# EAGLE design ESP32_Meteorologia_MTE_AV_2 (EAGLE 9.6.2)
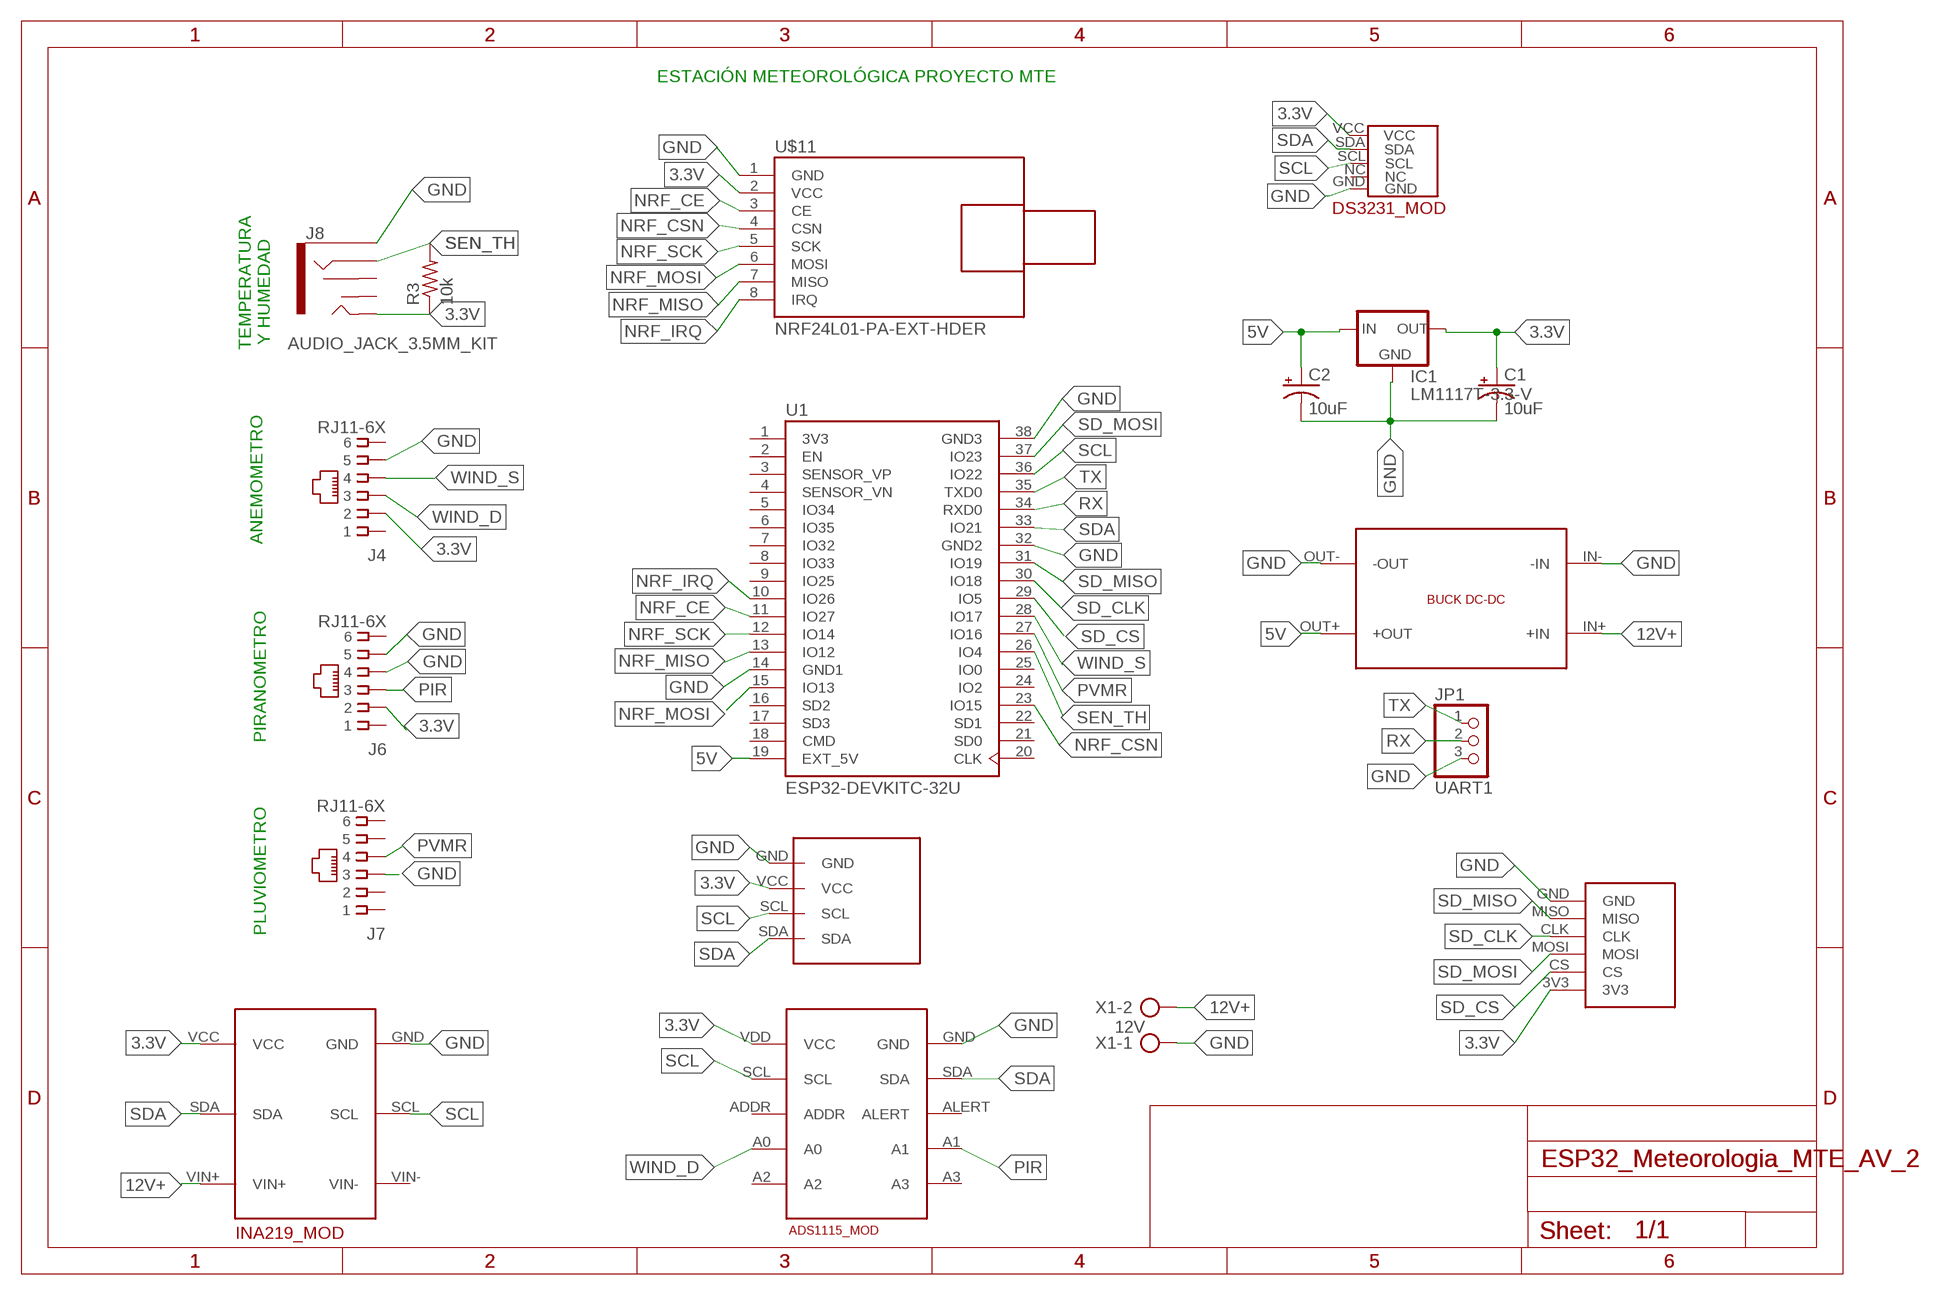
[diagram p0: schematic, sheet 1]

## Parts
C1  10uF  10UF-POLAR-RADIAL-2.5MM-25V-20%  [CPOL-RADIAL-2.5MM-5MM]
C2  10uF  10UF-POLAR-RADIAL-2.5MM-25V-20%  [CPOL-RADIAL-2.5MM-5MM]
IC1  LM1117T-3.3-V  [TO220V]
J4  RJ11-6X  [RJ11-NO_SHIELD]
J6  RJ11-6X  [RJ11-NO_SHIELD]
J7  RJ11-6X  [RJ11-NO_SHIELD]
J8  AUDIO_JACK_3.5MM_KIT  [AUDIO-JACK-KIT]
JP1  UART1  PINHD-1X3  [1X03]
R3  10k  R-US_0207/10  [0207/10]
U1  ESP32-DEVKITC-32U  [MODULE_ESP32-DEVKITC-32U]
U$1  ADS1115_BIG  [ADS1115_BIG]
U$2  MODULO_MSD2  [MICROSD-BREAKOUT]
U$7  INA219_MOD_HDR  [INA219_MOD_HDR]
U$8  BUCK_LM2596  [BUCK_LM2596]
U$10  DS3231_MOD  [DS3231_MOD]
U$11  NRF24L01-PA-EXT-HDER  [NRF24L01-HEADER]
U$12  OLED_I2C_096  [OLED_096_I2C]
X1  12V  AK500/2  [AK500/2]

## Nets
3.3V: C1.1(+) IC1.2(OUT) J4.2 J6.2 J8.TIP R3.1 U$1.VDD(VCC) U$2.3V3 U$7.VCC U$10.VCC U$11.2(VCC) U$12.VCC
5V: C2.1(+) IC1.3(IN) U1.19(EXT_5V) U$8.OUT+(+OUT)
12V+: U$7.VIN+ U$8.IN+(+IN) X1.2
GND: C1.2(-) C2.2(-) IC1.1(GND) J4.5 J6.4 J6.5 J7.3 J8.SLEEVE JP1.3 U1.14(GND1) U1.32(GND2) U1.38(GND3) U$1.GND U$2.GND U$7.GND U$8.IN-(-IN) U$8.OUT-(-OUT) U$10.GND U$11.1(GND) U$12.GND X1.1
NRF_CE: U1.11(IO27) U$11.3(CE)
NRF_CSN: U1.23(IO15) U$11.4(CSN)
NRF_IRQ: U1.10(IO26) U$11.8(IRQ)
NRF_MISO: U1.13(IO12) U$11.7(MISO)
NRF_MOSI: U1.15(IO13) U$11.6(MOSI)
NRF_SCK: U1.12(IO14) U$11.5(SCK)
PIR: J6.3 U$1.A1
PVMR: J7.4 U1.27(IO16)
RX: JP1.2 U1.34(RXD0)
SCL: U1.36(IO22) U$1.SCL U$7.SCL U$10.SCL U$12.SCL
SD_CLK: U1.30(IO18) U$2.CLK
SD_CS: U1.29(IO5) U$2.CS
SD_MISO: U1.31(IO19) U$2.MISO
SD_MOSI: U1.37(IO23) U$2.MOSI
SDA: U1.33(IO21) U$1.SDA U$7.SDA U$10.SDA U$12.SDA
SEN_TH: J8.RING R3.2 U1.26(IO4)
TX: JP1.1 U1.35(TXD0)
WIND_D: J4.3 U$1.A0
WIND_S: J4.4 U1.28(IO17)
Unconnected: J4.1 J4.6 J6.1 J6.6 J7.1 J7.2 J7.5 J7.6 J8.RSH J8.TSH U1.2(EN) U1.3(SENSOR_VP) U1.4(SENSOR_VN) U1.5(IO34) U1.6(IO35) U1.7(IO32) U1.8(IO33) U1.9(IO25) U1.16(SD2) U1.17(SD3) U1.18(CMD) U1.20(CLK) U1.21(SD0) U1.22(SD1) U1.24(IO2) U1.25(IO0) U$1.A2 U$1.A3 U$1.ADDR U$1.ALERT U$7.VIN- U$10.NC

## Notes on the sheet
- ESTACIÓN METEOROLÓGICA PROYECTO MTE
- TEMPERATURA
   Y HUMEDAD
- ANEMOMETRO
- PIRANOMETRO
- PLUVIOMETRO

## Power pins joined to a net without a drawn wire
3V3: U1.1(3V3)

## Library data of the parts
C1 C2 = SparkFun-Capacitors:10UF-POLAR: 10.0µF polarized capacitors A capacitor is a passive two-terminal electrical component used to store electrical energy temporarily in an electric field.; PROD_ID: CAP-08440
IC1 = lm1117:LM1117T-*
J4 J6 J7 = con-tycoelectronics:RJ11: CORCOM Modular RJ Jacks No Shield Source: www.tycoelectronics.com .. ENG_DS_1654001_1099_RJ_L_0507.pdf; MPN: RJ11-6X; OC_FARNELL: unknown; OC_NEWARK: 16R6089
J8 = SparkFun-Connectors:AUDIO_JACK_3.5MM: Audio Jack 3.5mm variants of PTH and SMT stereo audio jack with bypass switches. SparkFun Products: SparkFun SparkPunk Sound Kit <[https://www.sparkfun.com/products/11177]> - PTH MP3 Trigger <https://www.sparkfun.com/products/13720> -3.5mm SMD SparkFun PicoBoard <https://www.sparkfun.com/products/11888>- 2.5mm SMD; PROD_ID: CONN-08774; SF_ID: PRT-08032
JP1 = adafruit:PINHD-1X3: PIN HEADER
R3 = rcl:R-US_: RESISTOR, American symbol; SPICEPREFIX: R
U1 = ESP32-DEVKITC-32U:ESP32-DEVKITC-32U: ESP32-DEVKITC Check availability <https://pricing.snapeda.com/parts/ESP32-DEVKITC-32U/Espressif%20Systems/view-part?ref=eda>; AVAILABILITY: In Stock; DESCRIPTION: ESP32-WROOM-32UE series Transceiver; 802.11 b/g/n (Wi-Fi, WiFi, WLAN), Bluetooth® Smart Ready 4.x Dual Mode Evaluation Board; MF: Espressif Systems; MP: ESP32-DEVKITC-32U; PACKAGE: None; PRICE: None; PURCHASE-URL: https://pricing.snapeda.com/search/part/ESP32-DEVKITC-32U/?ref=eda
U$1 = ADS1115_MOD:ADS1115_BIG
U$2 = MSD2:MODULO_MSD2
U$7 = INA219_MOD:INA219_MOD_HDR
U$8 = BUCK_LM2596:BUCK_LM2596
U$10 = DS3231_,MOD:DS3231_MOD
U$11 = NRF24L01-Header:NRF24L01-PA-EXT-HDER
U$12 = OLED_I2C:OLED_I2C_096
X1 = con-ptr500:AK500/2: CONNECTOR; OC_FARNELL: unknown; OC_NEWARK: unknown

## Board
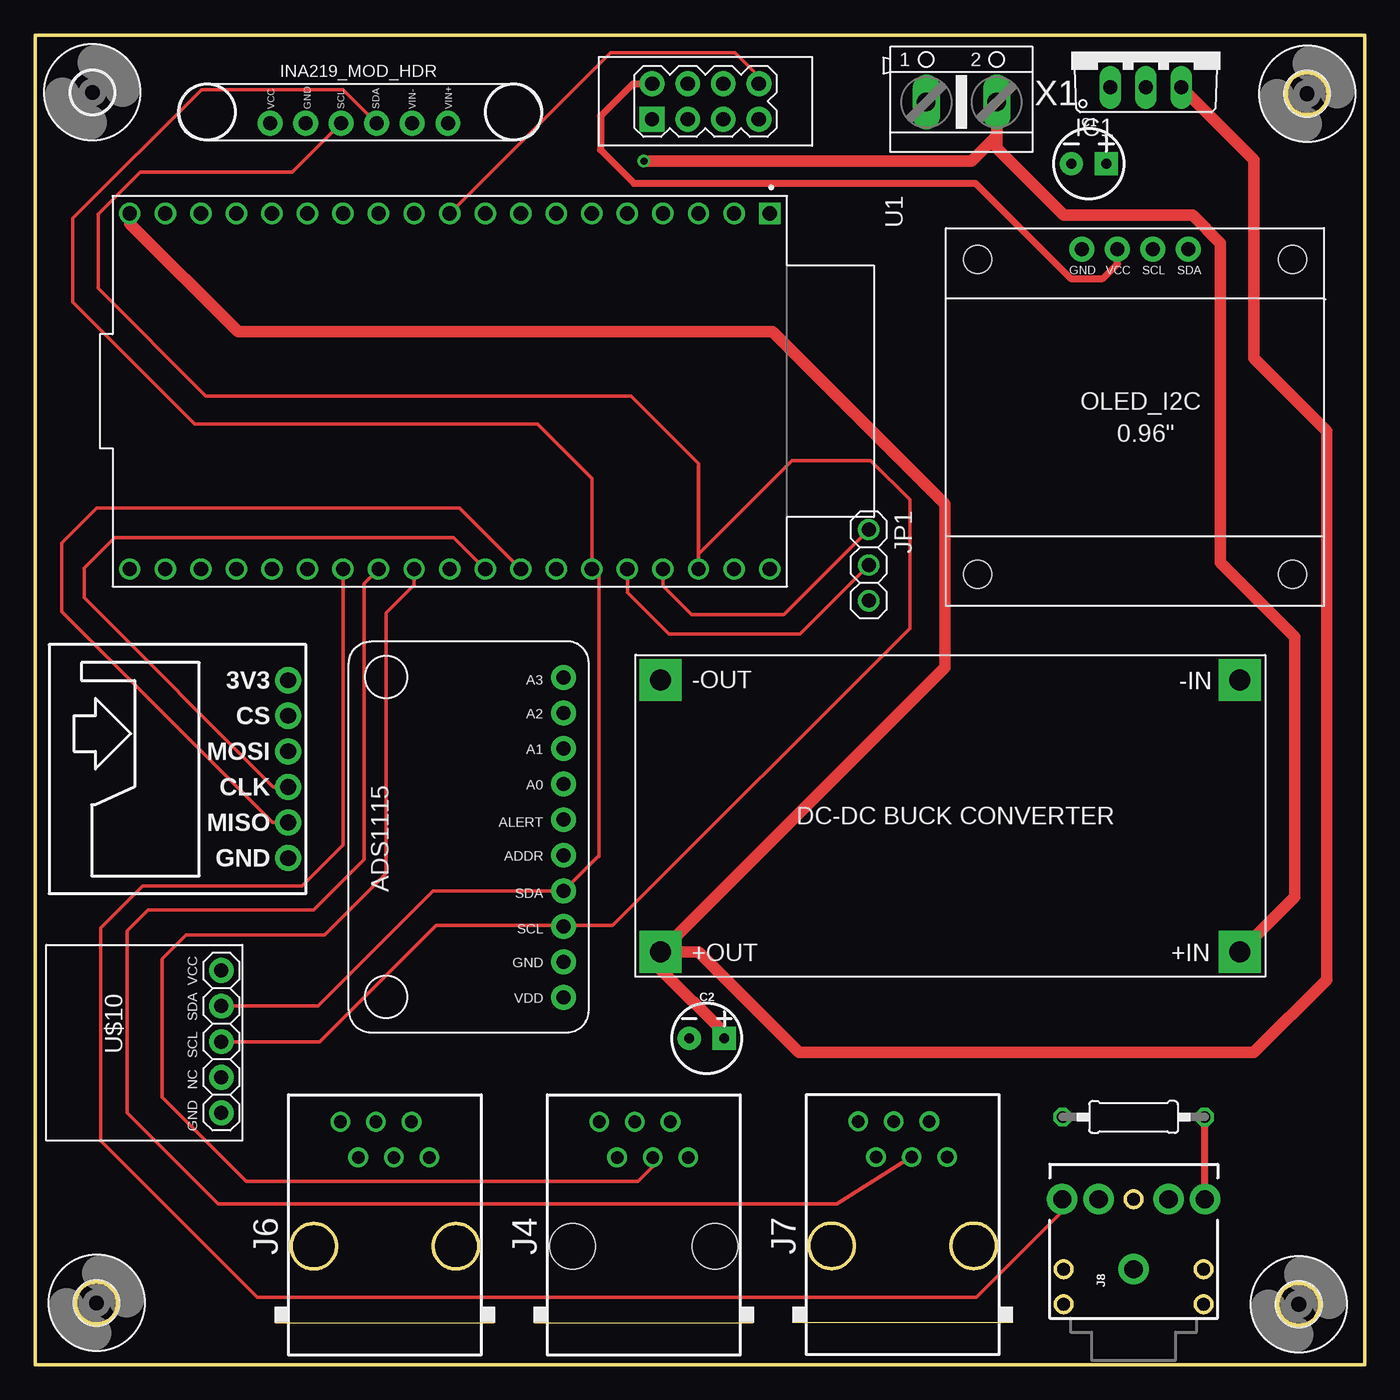
[diagram p1: board, top side]
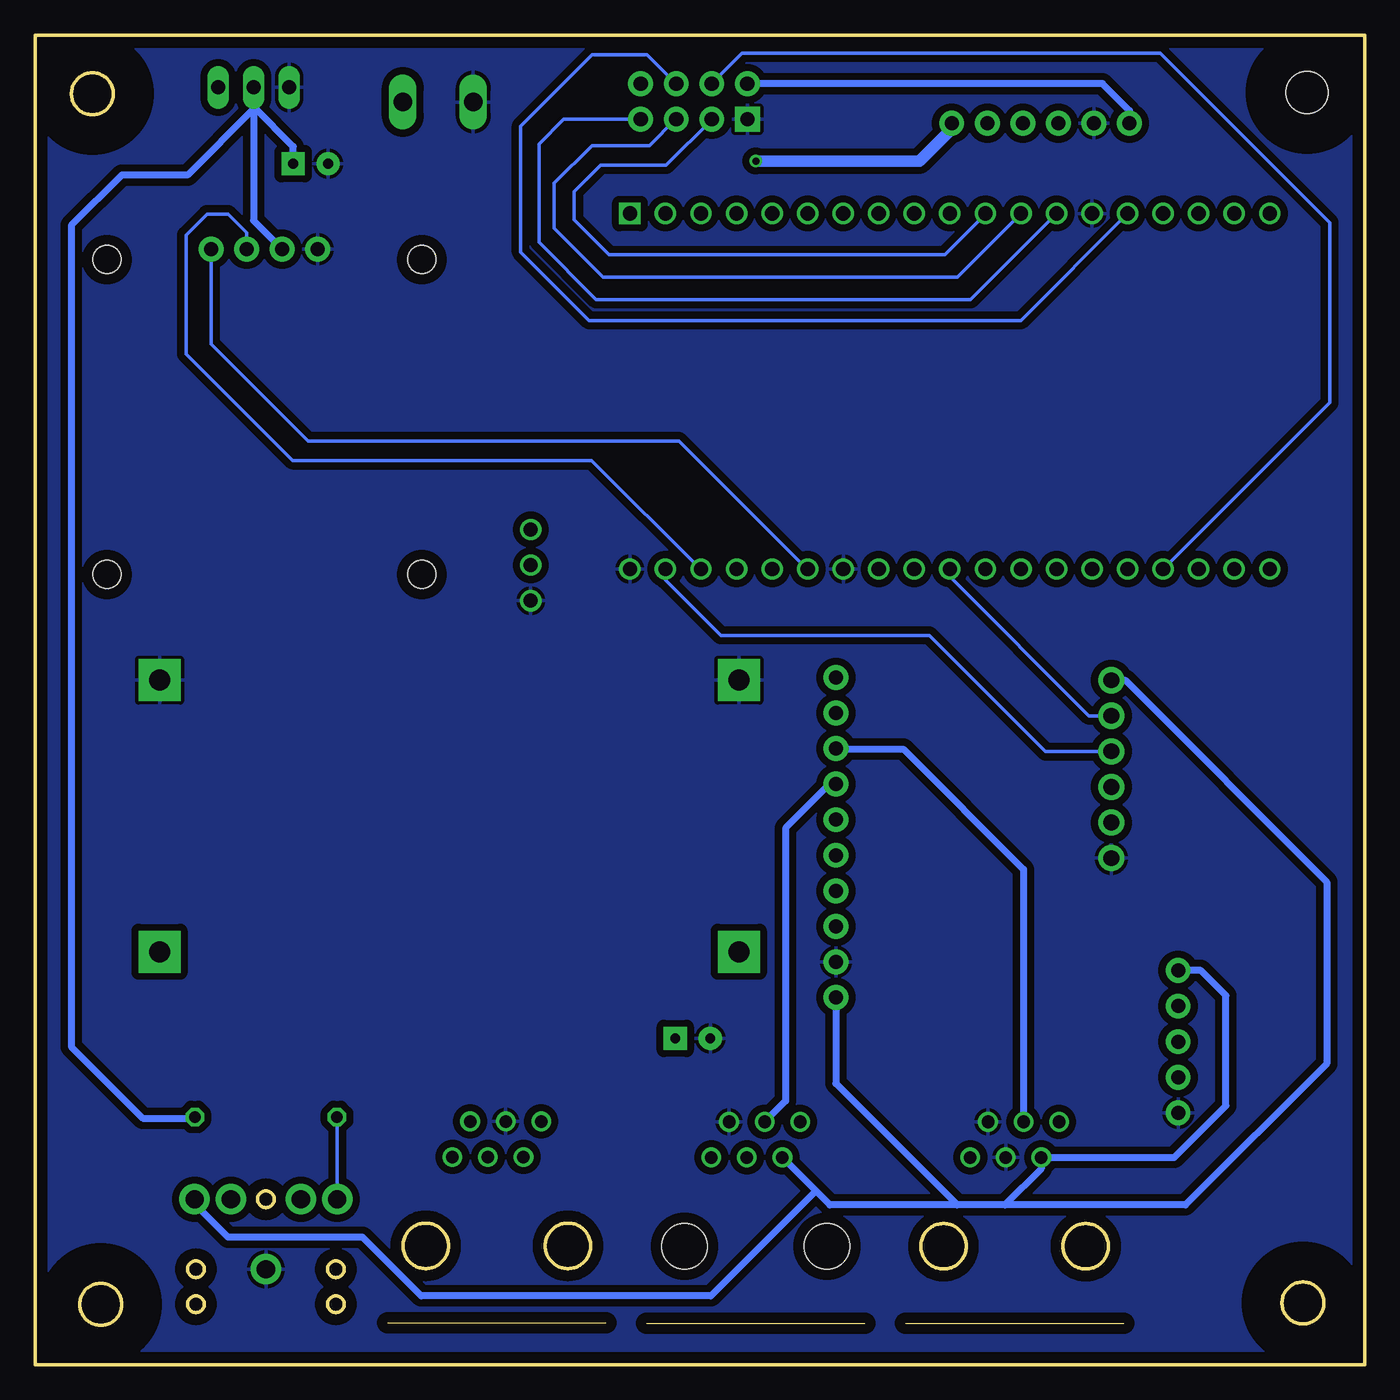
[diagram p2: board, bottom side, seen from below]

Size 95 x 95 mm. Coordinates in mm from the lower left corner, seen from the top.
Outline: 73.53,6.21 arc174 73.53,7.41 73.47,7.41 arc174 73.47,6.21 73.53,6.21
Outline: 73.53,3.71 arc174 73.53,4.91 73.47,4.91 arc174 73.47,3.71 73.53,3.71
Outline: 83.53,3.71 arc174 83.53,4.91 83.47,4.91 arc174 83.47,3.71 83.53,3.71
Outline: 83.53,6.21 arc174 83.53,7.41 83.47,7.41 arc174 83.47,6.21 83.53,6.21
Outline: 78.53,11.21 arc174 78.53,12.41 78.47,12.41 arc174 78.47,11.21 78.53,11.21
Outline: 68.7,8.64 68.71,8.53 68.71,8.43 68.7,8.32 68.69,8.21 68.66,8.11 68.64,8.01 68.6,7.91 68.56,7.81 68.51,7.71 68.46,7.62 68.4,7.53 68.34,7.45 68.27,7.37 68.19,7.29 68.11,7.22 68.03,7.16 67.94,7.1 67.85,7.05 67.75,7 67.65,6.96 67.55,6.92 67.45,6.9 67.34,6.88 67.24,6.86 67.13,6.85 67.03,6.85 66.92,6.86 66.81,6.88 66.71,6.9 66.61,6.92 66.51,6.96 66.41,7 66.31,7.05 66.22,7.1 66.13,7.16 66.05,7.22 65.97,7.29 65.89,7.37 65.82,7.45 65.76,7.53 65.7,7.62 65.65,7.71 65.6,7.81 65.56,7.91 65.52,8.01 65.5,8.11 65.47,8.21 65.46,8.32 65.45,8.43 65.45,8.53 65.46,8.64 65.47,8.74 65.5,8.85 65.52,8.95 65.56,9.05 65.6,9.15 65.65,9.25 65.7,9.34 65.76,9.43 65.82,9.51 65.89,9.59 65.97,9.67 66.05,9.74 66.13,9.8 66.22,9.86 66.31,9.91 66.41,9.96 66.51,10 66.61,10.04 66.71,10.06 66.81,10.09 66.92,10.1 67.03,10.11 67.13,10.11 67.24,10.1 67.34,10.09 67.45,10.06 67.55,10.04 67.65,10 67.75,9.96 67.85,9.91 67.94,9.86 68.03,9.8 68.11,9.74 68.19,9.67 68.27,9.59 68.34,9.51 68.4,9.43 68.46,9.34 68.51,9.25 68.56,9.15 68.6,9.05 68.64,8.95 68.66,8.85 68.69,8.74 68.7,8.64
Outline: 91.79,4.46 91.8,4.35 91.8,4.25 91.79,4.14 91.78,4.03 91.75,3.93 91.72,3.83 91.69,3.73 91.64,3.63 91.59,3.53 91.53,3.44 91.47,3.36 91.4,3.28 91.32,3.2 91.24,3.13 91.16,3.07 91.07,3.01 90.97,2.96 90.87,2.91 90.77,2.88 90.67,2.85 90.57,2.82 90.46,2.81 90.35,2.8 90.25,2.8 90.14,2.81 90.03,2.82 89.93,2.85 89.83,2.88 89.73,2.91 89.63,2.96 89.53,3.01 89.44,3.07 89.36,3.13 89.28,3.2 89.2,3.28 89.13,3.36 89.07,3.44 89.01,3.53 88.96,3.63 88.91,3.73 88.88,3.83 88.85,3.93 88.82,4.03 88.81,4.14 88.8,4.25 88.8,4.35 88.81,4.46 88.82,4.57 88.85,4.67 88.88,4.77 88.91,4.87 88.96,4.97 89.01,5.07 89.07,5.16 89.13,5.24 89.2,5.32 89.28,5.4 89.36,5.47 89.44,5.53 89.53,5.59 89.63,5.64 89.73,5.69 89.83,5.72 89.93,5.75 90.03,5.78 90.14,5.79 90.25,5.8 90.35,5.8 90.46,5.79 90.57,5.78 90.67,5.75 90.77,5.72 90.87,5.69 90.97,5.64 91.07,5.59 91.16,5.53 91.24,5.47 91.32,5.4 91.4,5.32 91.47,5.24 91.53,5.16 91.59,5.07 91.64,4.97 91.69,4.87 91.72,4.77 91.75,4.67 91.78,4.57 91.79,4.46
Outline: 58.54,8.64 58.55,8.53 58.55,8.43 58.54,8.32 58.52,8.21 58.5,8.11 58.48,8.01 58.44,7.91 58.4,7.81 58.35,7.71 58.3,7.62 58.24,7.53 58.18,7.45 58.11,7.37 58.03,7.29 57.95,7.22 57.87,7.16 57.78,7.1 57.69,7.05 57.59,7 57.49,6.96 57.39,6.92 57.29,6.9 57.19,6.88 57.08,6.86 56.97,6.85 56.87,6.85 56.76,6.86 56.66,6.88 56.55,6.9 56.45,6.92 56.35,6.96 56.25,7 56.15,7.05 56.06,7.1 55.97,7.16 55.89,7.22 55.81,7.29 55.73,7.37 55.66,7.45 55.6,7.53 55.54,7.62 55.49,7.71 55.44,7.81 55.4,7.91 55.36,8.01 55.34,8.11 55.31,8.21 55.3,8.32 55.29,8.43 55.29,8.53 55.3,8.64 55.31,8.74 55.34,8.85 55.36,8.95 55.4,9.05 55.44,9.15 55.49,9.25 55.54,9.34 55.6,9.43 55.66,9.51 55.73,9.59 55.81,9.67 55.89,9.74 55.97,9.8 56.06,9.86 56.15,9.91 56.25,9.96 56.35,10 56.45,10.04 56.55,10.06 56.66,10.09 56.76,10.1 56.87,10.11 56.97,10.11 57.08,10.1 57.19,10.09 57.29,10.06 57.39,10.04 57.49,10 57.59,9.96 57.69,9.91 57.78,9.86 57.87,9.8 57.95,9.74 58.03,9.67 58.11,9.59 58.18,9.51 58.24,9.43 58.3,9.34 58.35,9.25 58.4,9.15 58.44,9.05 58.48,8.95 58.5,8.85 58.52,8.74 58.54,8.64
Outline: 5.89,4.56 5.9,4.45 5.9,4.35 5.89,4.24 5.88,4.13 5.85,4.03 5.82,3.93 5.79,3.83 5.74,3.73 5.69,3.63 5.63,3.54 5.57,3.46 5.5,3.38 5.42,3.3 5.34,3.23 5.26,3.17 5.17,3.11 5.07,3.06 4.97,3.01 4.87,2.98 4.77,2.95 4.67,2.92 4.56,2.91 4.45,2.9 4.35,2.9 4.24,2.91 4.13,2.92 4.03,2.95 3.93,2.98 3.83,3.01 3.73,3.06 3.63,3.11 3.54,3.17 3.46,3.23 3.38,3.3 3.3,3.38 3.23,3.46 3.17,3.54 3.11,3.63 3.06,3.73 3.01,3.83 2.98,3.93 2.95,4.03 2.92,4.13 2.91,4.24 2.9,4.35 2.9,4.45 2.91,4.56 2.92,4.67 2.95,4.77 2.98,4.87 3.01,4.97 3.06,5.07 3.11,5.17 3.17,5.26 3.23,5.34 3.3,5.42 3.38,5.5 3.46,5.57 3.54,5.63 3.63,5.69 3.73,5.74 3.83,5.79 3.93,5.82 4.03,5.85 4.13,5.88 4.24,5.89 4.35,5.9 4.45,5.9 4.56,5.89 4.67,5.88 4.77,5.85 4.87,5.82 4.97,5.79 5.07,5.74 5.17,5.69 5.26,5.63 5.34,5.57 5.42,5.5 5.5,5.42 5.57,5.34 5.63,5.26 5.69,5.17 5.74,5.07 5.79,4.97 5.82,4.87 5.85,4.77 5.88,4.67 5.89,4.56
Outline: 92.39,90.96 92.4,90.85 92.4,90.75 92.39,90.64 92.38,90.53 92.35,90.43 92.32,90.33 92.29,90.23 92.24,90.13 92.19,90.03 92.13,89.94 92.07,89.86 92,89.78 91.92,89.7 91.84,89.63 91.76,89.57 91.67,89.51 91.57,89.46 91.47,89.41 91.37,89.38 91.27,89.35 91.17,89.32 91.06,89.31 90.95,89.3 90.85,89.3 90.74,89.31 90.63,89.32 90.53,89.35 90.43,89.38 90.33,89.41 90.23,89.46 90.13,89.51 90.04,89.57 89.96,89.63 89.88,89.7 89.8,89.78 89.73,89.86 89.67,89.94 89.61,90.03 89.56,90.13 89.51,90.23 89.48,90.33 89.45,90.43 89.42,90.53 89.41,90.64 89.4,90.75 89.4,90.85 89.41,90.96 89.42,91.07 89.45,91.17 89.48,91.27 89.51,91.37 89.56,91.47 89.61,91.57 89.67,91.66 89.73,91.74 89.8,91.82 89.88,91.9 89.96,91.97 90.04,92.03 90.13,92.09 90.23,92.14 90.33,92.19 90.43,92.22 90.53,92.25 90.63,92.28 90.74,92.29 90.85,92.3 90.95,92.3 91.06,92.29 91.17,92.28 91.27,92.25 91.37,92.22 91.47,92.19 91.57,92.14 91.67,92.09 91.76,92.03 91.84,91.97 91.92,91.9 92,91.82 92.07,91.74 92.13,91.66 92.19,91.57 92.24,91.47 92.29,91.37 92.32,91.27 92.35,91.17 92.38,91.07 92.39,90.96
Outline: 31.7,8.61 31.71,8.5 31.71,8.4 31.7,8.29 31.68,8.19 31.66,8.08 31.64,7.98 31.6,7.88 31.56,7.78 31.51,7.68 31.46,7.59 31.4,7.5 31.34,7.42 31.27,7.34 31.19,7.26 31.11,7.19 31.03,7.13 30.94,7.07 30.85,7.02 30.75,6.97 30.65,6.93 30.55,6.89 30.45,6.87 30.34,6.84 30.24,6.83 30.13,6.82 30.03,6.82 29.92,6.83 29.82,6.84 29.71,6.87 29.61,6.89 29.51,6.93 29.41,6.97 29.31,7.02 29.22,7.07 29.13,7.13 29.05,7.19 28.97,7.26 28.89,7.34 28.82,7.42 28.76,7.5 28.7,7.59 28.65,7.68 28.6,7.78 28.56,7.88 28.52,7.98 28.5,8.08 28.48,8.19 28.46,8.29 28.45,8.4 28.45,8.5 28.46,8.61 28.48,8.71 28.5,8.82 28.52,8.92 28.56,9.02 28.6,9.12 28.65,9.22 28.7,9.31 28.76,9.4 28.82,9.48 28.89,9.56 28.97,9.64 29.05,9.71 29.13,9.77 29.22,9.83 29.31,9.88 29.41,9.93 29.51,9.97 29.61,10.01 29.71,10.03 29.82,10.05 29.92,10.07 30.03,10.08 30.13,10.08 30.24,10.07 30.34,10.05 30.45,10.03 30.55,10.01 30.65,9.97 30.75,9.93 30.85,9.88 30.94,9.83 31.03,9.77 31.11,9.71 31.19,9.64 31.27,9.56 31.34,9.48 31.4,9.4 31.46,9.31 31.51,9.22 31.56,9.12 31.6,9.02 31.64,8.92 31.66,8.82 31.68,8.71 31.7,8.61
Outline: 21.54,8.61 21.55,8.5 21.55,8.4 21.54,8.29 21.52,8.19 21.5,8.08 21.48,7.98 21.44,7.88 21.4,7.78 21.35,7.68 21.3,7.59 21.24,7.5 21.18,7.42 21.11,7.34 21.03,7.26 20.95,7.19 20.87,7.13 20.78,7.07 20.69,7.02 20.59,6.97 20.49,6.93 20.39,6.89 20.29,6.87 20.18,6.84 20.08,6.83 19.97,6.82 19.87,6.82 19.76,6.83 19.66,6.84 19.55,6.87 19.45,6.89 19.35,6.93 19.25,6.97 19.15,7.02 19.06,7.07 18.97,7.13 18.89,7.19 18.81,7.26 18.73,7.34 18.66,7.42 18.6,7.5 18.54,7.59 18.49,7.68 18.44,7.78 18.4,7.88 18.36,7.98 18.34,8.08 18.32,8.19 18.3,8.29 18.29,8.4 18.29,8.5 18.3,8.61 18.32,8.71 18.34,8.82 18.36,8.92 18.4,9.02 18.44,9.12 18.49,9.22 18.54,9.31 18.6,9.4 18.66,9.48 18.73,9.56 18.81,9.64 18.89,9.71 18.97,9.77 19.06,9.83 19.15,9.88 19.25,9.93 19.35,9.97 19.45,10.01 19.55,10.03 19.66,10.05 19.76,10.07 19.87,10.08 19.97,10.08 20.08,10.07 20.18,10.05 20.29,10.03 20.39,10.01 20.49,9.97 20.59,9.93 20.69,9.88 20.78,9.83 20.87,9.77 20.95,9.71 21.03,9.64 21.11,9.56 21.18,9.48 21.24,9.4 21.3,9.31 21.35,9.22 21.4,9.12 21.44,9.02 21.48,8.92 21.5,8.82 21.52,8.71 21.54,8.61
Outline: 0,95 0,0 95,0 95,95 0,95
Copper layers (1*16): Top 0.035mm / dielectric 1.5mm / Bottom 0.035mm
Design rules "default *": minimum track width 6mil, minimum drill 0.35mm, track to track 20mil, track to pad 20mil, pad to pad 0.4mm, via to via 20mil, smd to smd 20mil, copper to edge 30mil, drill to drill 6mil, minimum pad ring 10mil, minimum via ring 8mil, stop-mask expansion 4mil, vias tented up to drill 0mil, thermal gap 10mil
Holes 3 mm at 4.4,4.4 4.1,90.9 90.9,90.8 90.3,4.3
Holes 2 mm at 89.85,78.95 67.35,78.95 67.35,56.45 89.85,56.45
Holes 1.2 mm at 73.5,6.81 73.5,4.31 83.5,4.31 83.5,6.81 78.5,11.81
Holes 3.25 mm at 38.42,8.45 48.58,8.45 19.92,8.45 30.08,8.45 56.92,8.48 67.08,8.48

### Footprints (pad centres in the part's own frame; a part is rotated, then mirrored left to right if it is on the bottom)
CPOL-RADIAL-2.5MM-5MM = drill 0.7 pad 1.651 square: 1 1.25,0 | drill 0.7 pad 1.651: 2 -1.25,0
TO220V = drill 1.016 long: 1 -2.54,-2.54; 2 0,-2.54; 3 2.54,-2.54
RJ11-NO_SHIELD = drill 0.9 pad 1.4: 1 -3.175,8.89; 2 -1.905,6.35; 3 -0.635,8.89; 4 0.635,6.35; 5 1.905,8.89; 6 3.175,6.35 | hole 3.251: -5.08,0; 5.08,0
AUDIO-JACK-KIT = drill 1.3 pad 2.184: RING 5,5.1; RSH 5,2.5; SLEEVE 0,0; TIP 5,-5.1; TSH 5,-2.5 | hole 1.2: 0,5; -2.5,5; -2.5,-5; 0,-5; 5,0
1X03 = drill 1.016: 1 -2.54,0; 2 0,0; 3 2.54,0
0207/10 = drill 0.813 octagon: 1 -5.08,0; 2 5.08,0
MODULE_ESP32-DEVKITC-32U = drill 1.02 square: 1 -12.7,22.85 | drill 1.02: 2 -12.7,20.31; 3 -12.7,17.77; 4 -12.7,15.23; 5 -12.7,12.69; 6 -12.7,10.15; 7 -12.7,7.61; 8 -12.7,5.07; 9 -12.7,2.53; 10 -12.7,-0.01; 11 -12.7,-2.55; 12 -12.7,-5.09; 13 -12.7,-7.63; 14 -12.7,-10.17; 15 -12.7,-12.71; 16 -12.7,-15.25; 17 -12.7,-17.79; 18 -12.7,-20.33; 19 -12.7,-22.87; 20 12.7,-22.87; 21 12.7,-20.33; 22 12.7,-17.79; 23 12.7,-15.25; 24 12.7,-12.71; 25 12.7,-10.17; 26 12.7,-7.63; 27 12.7,-5.09; 28 12.7,-2.55; 29 12.7,-0.01; 30 12.7,2.53; 31 12.7,5.07; 32 12.7,7.61; 33 12.7,10.15; 34 12.7,12.69; 35 12.7,15.23; 36 12.7,17.77; 37 12.7,20.31; 38 12.7,22.85
ADS1115_BIG = drill 1 pad 1.778: A0 3.77,-6.775; A1 6.31,-6.775; A2 8.85,-6.775; A3 11.39,-6.775; ADDR -1.31,-6.775; ALERT 1.23,-6.775; GND -8.93,-6.775; SCL -6.39,-6.775; SDA -3.85,-6.775; VDD -11.47,-6.775
MICROSD-BREAKOUT = drill 1.118 pad 1.88: 3V3 -5.89,8.7; CLK 1.73,8.7; CS -3.35,8.7; GND 6.81,8.7; MISO 4.27,8.7; MOSI -0.81,8.7
3,0 = hole 3: 0,0
INA219_MOD_HDR = drill 1 pad 1.778: GND -3.86,-0.8; SCL -1.32,-0.8; SDA 1.22,-0.8; VCC -6.4,-0.8; VIN+ 6.3,-0.8; VIN- 3.76,-0.8
BUCK_LM2596 = drill 1.5 pad 3 square: IN+ 20.7,-9.7; IN- 20.7,9.7; OUT+ -20.7,-9.7; OUT- -20.7,9.7
DS3231_MOD = drill 1 pad 1.778: GND 5.01,5.51; NC 2.47,5.51; SCL -0.07,5.51; SDA -2.61,5.51; VCC -5.15,5.51
NRF24L01-HEADER = drill 1 pad 1.778 square: 1 -1.335,3.91 | drill 1.016 pad 1.778: 2 1.205,3.91; 3 -1.335,1.37; 4 1.205,1.37; 5 -1.335,-1.17; 6 1.205,-1.17; 7 -1.335,-3.71; 8 1.205,-3.71
OLED_096_I2C = drill 1 pad 1.778: GND -3.8,12; SCL 1.28,12; SDA 3.82,12; VCC -1.26,12 | hole 2: -11.25,11.25; -11.25,-11.25; 11.25,-11.25; 11.25,11.25
AK500/2 = drill 1.321 long: 1 -2.515,0; 2 2.515,0

### Placement (x,y rotation side)
C1  75.3,85.8 0 top
C2  48,23.3 0 top
IC1  79.38,93.8 0 top
J4  43.5,8.45 0 top
J6  25,8.45 0 top
J7  62,8.48 0 top
J8  78.5,6.81 90 top
JP1  59.58,57.12 270 top
R3  78.5,17.68 180 top
U1  29.64,69.54 270 top
U$1  31,37.7 90 top
U$2  9.39,43 270 top
U$3  [3,0]  4.1,90.9 0 top
U$4  [3,0]  90.9,90.8 0 top
U$5  [3,0]  90.3,4.3 0 top
U$6  [3,0]  4.4,4.4 0 top
U$7  23.2,89.5 0 top
U$8  65.4,39.2 0 top
U$10  7.81,23 270 top
U$11  48.01,90.32 90 top
U$12  78.6,67.7 0 top
X1  66.2,90.21 0 top

### Tracks (layer width: path | path; a pad name or v marks a point on that pad's centre or on a via)
3.3V
  Top 0.508: U$11.2 44.08,91.5 42.7,91.5 40.4,89.2 40.4,86.8 42.8,84.4 67.21,84.4 74.01,77.6 76.3,77.6 77.34,78.64 U$12.VCC | J8.TIP 83.58,11.81 83.58,11.83 R3.1
  Bottom 0.508: U$2.3V3 17.1,48.9 2.7,34.5 2.7,21.5 12.8,11.4 25.7,11.4 | 79.31,89.79 79.38,89.72 | 79.38,89.72 84.1,85 88.8,85 92.4,81.4 92.4,22.7 87.3,17.6 83.16,17.6 R3.1 | U$7.VCC 16.8,89.6 18.73,91.53 U$11.2 | IC1.2 79.38,89.86 79.31,89.79 | C1.1 76.55,87.03 79.31,89.79 | 39.21,12.4 46.71,4.9 67.4,4.9 71.6,9.1 81.2,9.1 83.6,11.5 J8.TIP | 29.1,11.4 38.21,11.4 39.21,12.4 | J4.2 41.59,14.79 39.21,12.4 | U$12.VCC 79.38,81.74 79.38,89.72 | 25.7,11.4 23.09,14 J6.2 13.6,14.8 9.9,18.5 9.9,26.36 11.69,28.15 U$10.VCC | 25.7,11.4 29.1,11.4 | U$1.VDD 37.77,20.07 29.1,11.4
5V
  Top 0.813: U1.19 6.77,81.53 14.5,73.8 52.7,73.8 65,61.5 65,49.8 U$8.OUT+ | U$8.OUT+ 47.4,29.5 54.6,22.3 87.1,22.3 92.3,27.5 92.3,66.7 87.1,71.9 87.1,86.08 IC1.3 | U$8.OUT+ 44.7,28.25 49.25,23.7 C2.1
12V+  (via drill 0.5)
  Top 0.813: U$8.IN+ 90,33.4 90,52 84.7,57.3 84.7,80.12 82.72,82.11 73.52,82.11 68.72,86.91 X1.2 68.72,87.81 66.9,86 v43.5,86
  Bottom 0.813: U$7.VIN+ 29.5,88.3 31.8,86 v43.5,86
GND
  pour Bottom (isolate 0.305): 0.1,-0.1 0.1,94.8 0.3,95 95.3,95 95.3,-0.1 94.9,-0.1
NRF_CE
  Bottom 0.254: U$11.3 46.64,88.96 49.9,85.7 54.6,85.7 56.5,83.8 56.5,81.8 54,79.3 30,79.3 27.09,82.21 U1.11
NRF_CSN
  Bottom 0.254: U1.23 2.5,68.73 2.5,81.59 14.61,93.7 44.5,93.7 46.64,91.56 U$11.4
NRF_IRQ
  Top 0.254: U$11.8 51.72,92.02 50.01,93.73 41.12,93.73 U1.10
NRF_MISO
  Bottom 0.254: U1.13 28.15,76.1 54.9,76.1 59,80.2 59,87.2 57.22,88.98 U$11.7
NRF_MOSI
  Bottom 0.254: U1.15 24.57,74.6 55.4,74.6 60.3,79.5 60.3,88.5 55.2,93.6 51.28,93.6 49.2,91.53 U$11.6
NRF_SCK
  Bottom 0.254: U1.12 29.09,77.7 54.4,77.7 57.9,81.2 57.9,84.4 55.2,87.1 51.1,87.1 49.22,88.98 U$11.5
PIR
  Bottom 0.254: U$1.A1 37.73,43.97
  Bottom 0.508: J6.3 24.36,35.38 32.95,43.97 37.73,43.97
PVMR
  Top 0.254: U1.27 23.5,55.79 23.5,36.1 19.9,32.5 8.1,32.5 6.6,31 6.6,18 13.1,11.5 57.3,11.5 J7.4
RX
  Top 0.254: U1.34 42.33,55.17 45.3,52.2 54.66,52.2 JP1.2
SCL
  Top 0.152: 37.72,31.37 U$1.SCL 37.84,31.37
  Top 0.254: U$7.SCL 18.38,85.2 7.5,85.2 4.5,82.2 4.5,76.9 12.2,69.2 42.6,69.2 47.41,64.39 U1.36 47.41,57.91 54.1,64.6 59.7,64.6 62.5,61.8 62.5,52.6 41.27,31.37 37.84,31.37 | U$10.SCL 13.34,23.05 20.34,23.05 28.66,31.37 37.72,31.37
  Bottom 0.254: U1.36 47.46,56.84 55.22,64.6 76.6,64.6 84.2,72.2 84.2,80.7 82.7,82.2 81.2,82.2 79.88,80.88 U$12.SCL
SD_CLK
  Top 0.254: U$2.CLK 17.03,41.27 3.5,54.8 3.5,56.9 5.7,59.1 29.91,59.1 U1.30
SD_CS
  Bottom 0.254: U1.29 29.63,56.3 19.68,46.35 U$2.CS
SD_MISO
  Top 0.254: U$2.MISO 16.99,38.73 1.9,53.8 1.9,58.7 4.4,61.2 30.35,61.2 U1.31
SD_MOSI
  Bottom 0.254: U$2.MOSI 22.8,43.8 31.1,52.1 46,52.1 49.95,56.05 U1.37
SDA
  Top 0.254: U$7.SDA 22.02,91.1 11.91,91.1 2.7,81.89 2.7,75.9 11.4,67.2 35.9,67.2 39.79,63.31 U1.33 40.29,56.34 40.29,36.29 40.22,36.29 U$1.SDA 28.46,33.85 20.22,25.61 U$10.SDA
  Bottom 0.254: U1.33 39.84,56.84 49,66 75.5,66 82.42,72.92 U$12.SDA
SEN_TH
  Top 0.254: U1.26 22.01,37.11 19.1,34.2 7.7,34.2 4.7,31.2 4.7,16 15.89,4.81 67.27,4.81 73.4,10.94 J8.RING
  Bottom 0.254: R3.2 73.42,11.83 J8.RING
TX
  Top 0.254: U1.35 44.87,55.64 46.91,53.6 53.52,53.6 JP1.1
WIND_D
  Bottom 0.508: J4.3 41.37,18.84 41.37,38.33 38.23,41.47 U$1.A0
WIND_S
  Top 0.254: U1.28 27.09,55.71 27.1,55.7 25.1,53.7 25.1,35.1 20.7,30.7 10.8,30.7 9.1,29 9.1,19.1 15.1,13.1 43.1,13.1 44.13,14.13 J4.4